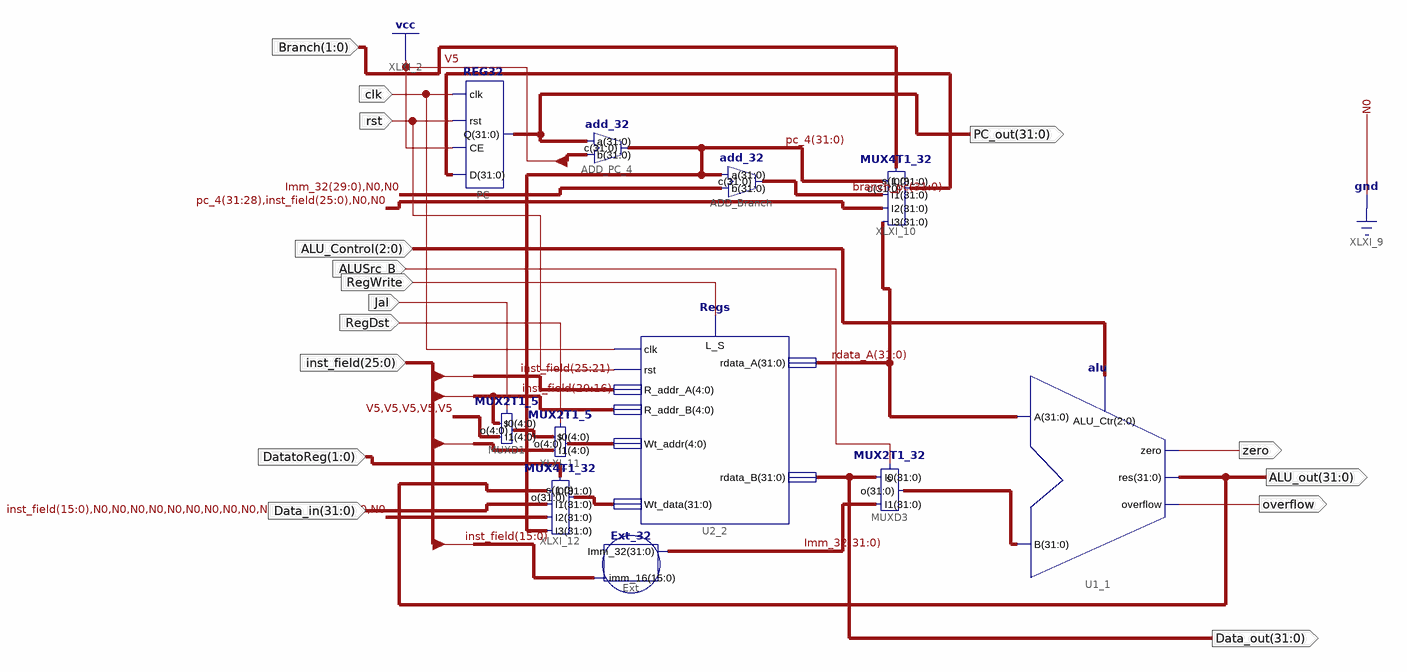
[diagram p0: schematic sheet 1]
// Xilinx ISE schematic Data_path_more.sch (kintex7) as structural Verilog: 11 symbols, 16 ports
module Data_path_more (
  input  clk,
  input  rst,
  input  [2:0] ALU_Control,
  input  ALUSrc_B,
  input  RegWrite,
  input  [25:0] inst_field,
  input  [1:0] DatatoReg,
  input  [31:0] Data_in,
  input  [1:0] Branch,
  input  Jal,
  input  RegDst,
  output [31:0] PC_out,
  output [31:0] Data_out,
  output [31:0] ALU_out,
  output zero,
  output overflow
);

  wire [4:0] XLXN_66, XLXN_67;
  wire [31:0] branch_pc, Imm_32, pc_4, rdata_A, XLXN_10, XLXN_27, XLXN_73;

  REG32 PC (.D(XLXN_10), .CE(1'b1), .rst(rst), .clk(clk), .Q(PC_out));
  add_32 ADD_PC_4 (.c(pc_4), .a(PC_out), .b(32'b00000000000000000000000000000100));
  add_32 ADD_Branch (.c(branch_pc), .a(pc_4), .b({Imm_32[29:0], 2'b00}));
  Regs #(.VeriModel("Regs")) U2_2 (
    .clk(clk), .L_S(RegWrite), .rdata_A(rdata_A), .rst(rst), .Wt_data(XLXN_73), .rdata_B(Data_out),
    .R_addr_A(inst_field[25:21]), .R_addr_B(inst_field[20:16]), .Wt_addr(XLXN_67));
  MUX2T1_32 MUXD3 (.s(ALUSrc_B), .I0(Data_out), .I1(Imm_32), .o(XLXN_27));
  alu U1_1 (.ALU_Ctr(ALU_Control), .res(ALU_out), .zero(zero), .overflow(overflow), .A(rdata_A), .B(XLXN_27));
  MUX2T1_5 MUXD1 (.I1({5{1'b1}}), .I0(inst_field[20:16]), .o(XLXN_66), .s(Jal));
  Ext_32 Ext (.imm_16(inst_field[15:0]), .Imm_32(Imm_32));
  MUX4T1_32 XLXI_10 (
    .s(Branch), .I0(pc_4), .I1(branch_pc), .I2({pc_4[31:28], inst_field, 2'b00}), .I3(rdata_A), .o(XLXN_10));
  MUX2T1_5 XLXI_11 (.I1(inst_field[15:11]), .I0(XLXN_66), .o(XLXN_67), .s(RegDst));
  MUX4T1_32 XLXI_12 (
    .s(DatatoReg), .I0(ALU_out), .I1(Data_in), .I2({inst_field[15:0], {16{1'b0}}}), .I3(pc_4), .o(XLXN_73));
endmodule
